# Altium schematic sheet LAN8720A.SchDoc
size A4
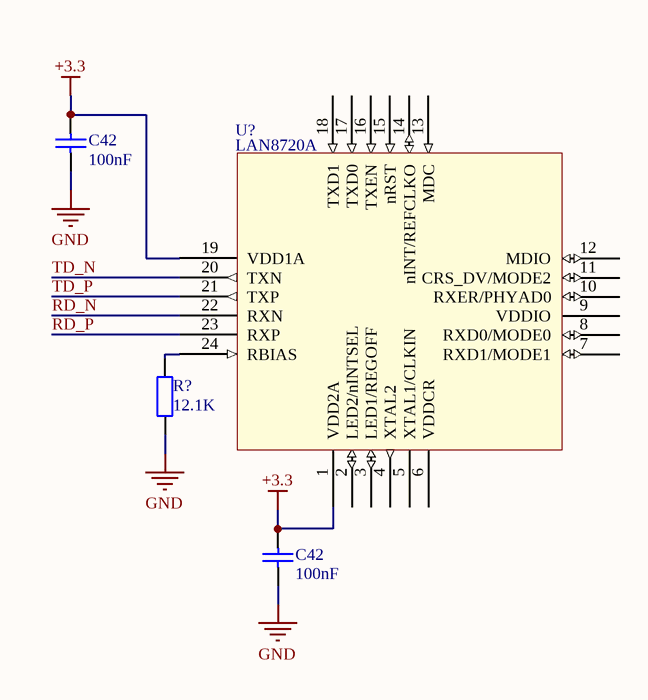
[diagram p0: LAN8720A.SchDoc]

## Parts
(Parts that share a designator on the sheet are numbered #1, #2 ... from top to bottom, then left to right.)
C42#1  100nF  [C0805]
C42#2  100nF  [C0805]
R?  12.1K  [R0805]
U?  LAN8720A

## Nets
+3.3: C42#1.1 C42#2.1 U?.1(VDD2A) U?.19(VDD1A)
GND: C42#1.2 C42#2.2 R?.1
RD_N: U?.22(RXN)
RD_P: U?.23(RXP)
TD_N: U?.20(TXN)
TD_P: U?.21(TXP)
NetR?_2: R?.2 U?.24(RBIAS)

Not connected (* = marked no-connect by the designer): U? 2(LED2/nINTSEL) 3(LED1/REGOFF) 4(XTAL2) 5(XTAL1/CLKIN) 6(VDDCR) 7(RXD1/MODE1) 8(RXD0/MODE0) 9(VDDIO) 10(RXER/PHYAD0) 11(CRS_DV/MODE2) 12(MDIO) 13(MDC) 14(nINT/REFCLKO) 15(nRST) 16(TXEN) 17(TXD0) 18(TXD1)

## Library data of the parts
C42#1 C42#2 = Cap 0805 100nF: Capacitor; Manufacturer: MULTICOMP; Manufacturer Part Number: MCCA000296; Supplier 1: Farnell; Supplier Part Number 1: 1759167; Pricing 1: 100=0,01, 500=0,008, 1000=0,006, 4000=0,005 (EUR); ComponentLink1URL: http://www.farnell.com/datasheets/1520827.pdf; ComponentLink1Description: http://www.farnell.com/datasheets/1520827.pdf
R? = Resistor 0805 2.2K: Resistor